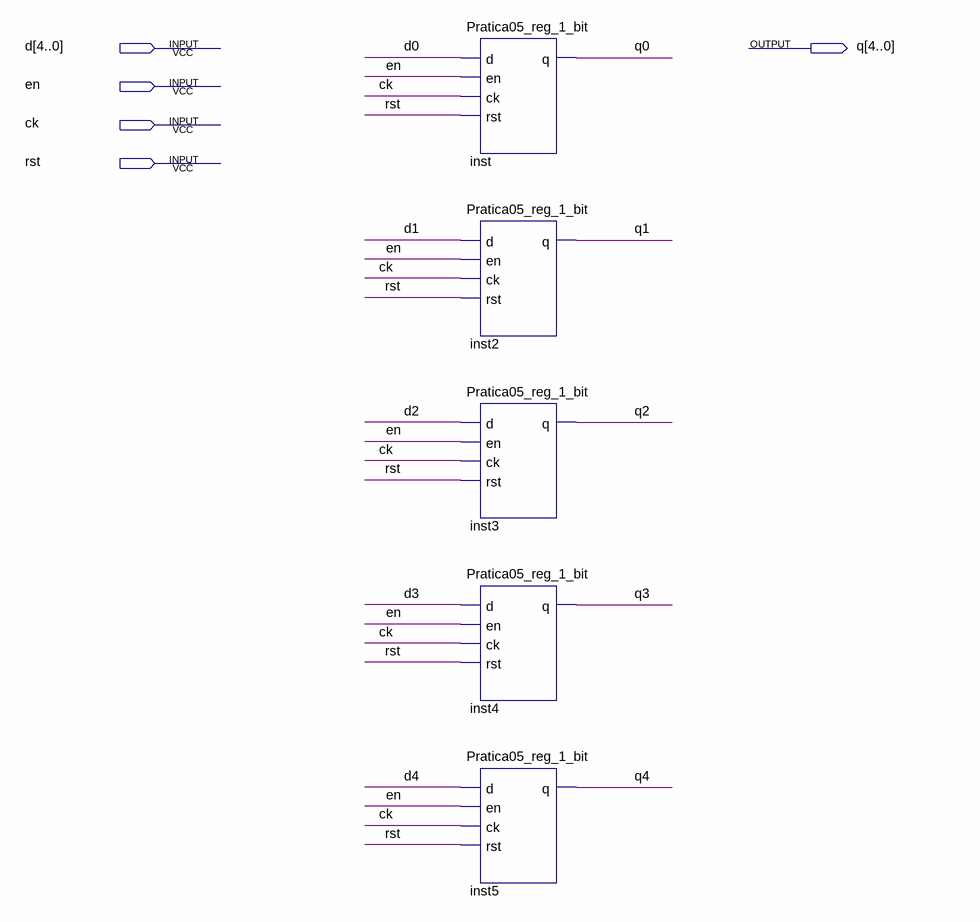
[diagram p0: schematic sheet]
// Quartus schematic Pratica05_reg_5_bits.bdf as structural Verilog: 5 symbols, 5 pins
module Pratica05_reg_5_bits (
  input  [4:0] d,
  input  en,
  input  ck,
  input  rst,
  output [4:0] q
);

  Pratica05_reg_1_bit inst (.d(d[0]), .en(en), .ck(ck), .rst(rst), .q(q[0]));
  Pratica05_reg_1_bit inst2 (.d(d[1]), .en(en), .ck(ck), .rst(rst), .q(q[1]));
  Pratica05_reg_1_bit inst3 (.d(d[2]), .en(en), .ck(ck), .rst(rst), .q(q[2]));
  Pratica05_reg_1_bit inst4 (.d(d[3]), .en(en), .ck(ck), .rst(rst), .q(q[3]));
  Pratica05_reg_1_bit inst5 (.d(d[4]), .en(en), .ck(ck), .rst(rst), .q(q[4]));
endmodule
